# EAGLE design Qwiic_LoRa (EAGLE 7.7.0)
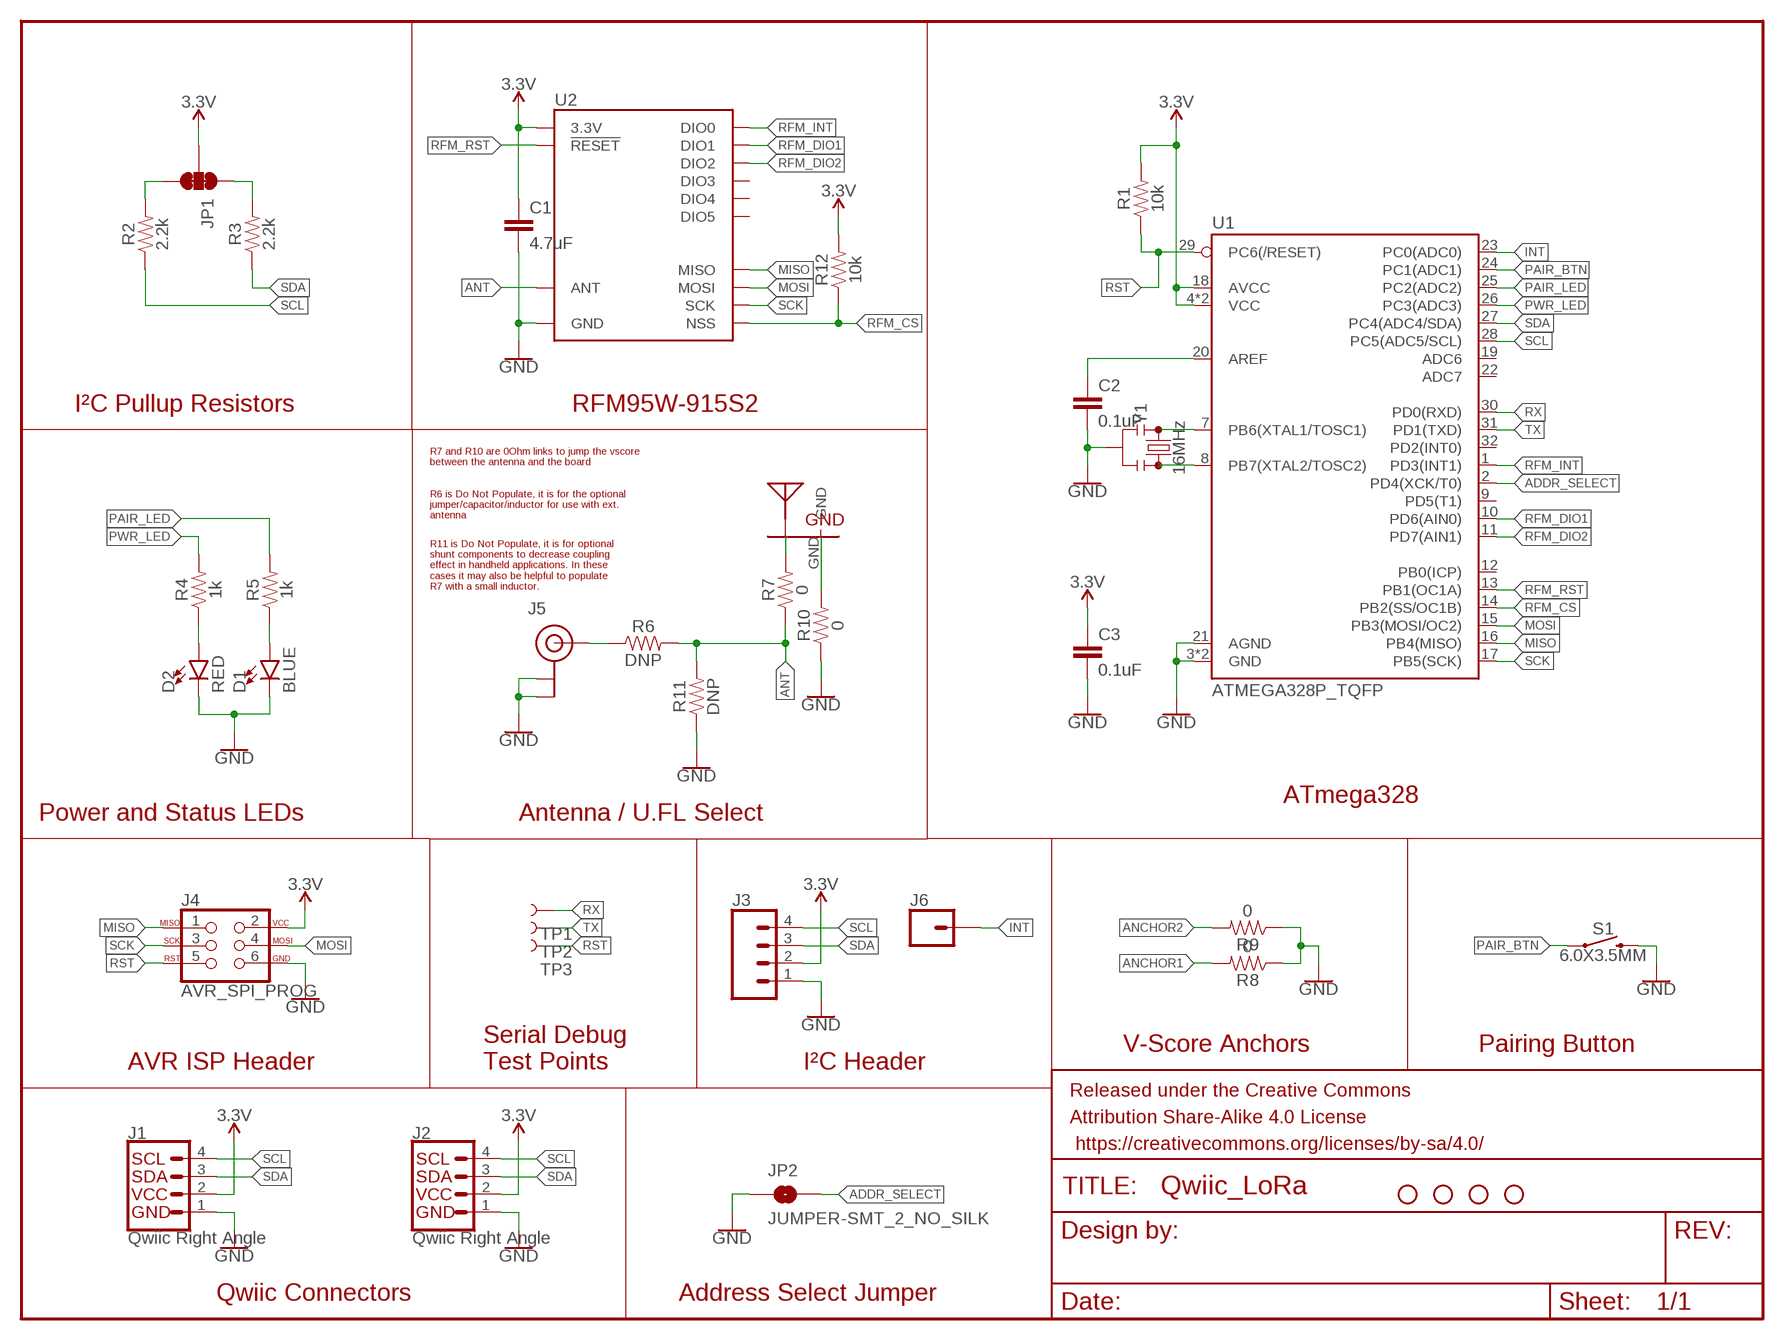
[diagram p0: schematic, sheet 1]

## Parts
C1  4.7uF  4.7UF0603  [0603]
C2  0.1uF  0.1UF-0603-25V-(+80/-20%)  [0603]
C3  0.1uF  0.1UF-0603-25V-(+80/-20%)  [0603]
D1  BLUE  LED-BLUE0603  [LED-0603]
D2  RED  LED-RED0603  [LED-0603]
FRAME1  FRAME-LETTER  [CREATIVE_COMMONS]
H1  STAND-OFF  [STAND-OFF]
H2  STAND-OFF  [STAND-OFF]
H3  STAND-OFF  [STAND-OFF]
H4  STAND-OFF  [STAND-OFF]
J1  Qwiic Right Angle  I2C_STANDARDQWIIC  [1X04_1MM_RA]
J2  Qwiic Right Angle  I2C_STANDARDQWIIC  [1X04_1MM_RA]
J3  CONN_041X04_NO_SILK  [1X04_NO_SILK]
J4  AVR_SPI_PROG  AVR_SPI_PROG_3X2TESTPOINTS  [2X3_TEST_POINTS]
J5  U.FL  [U.FL]
J6  CONN_01PTH_NO_SILK_YES_STOP  [1X01_NO_SILK]
JP1  JUMPER-SMT_3_2-NC_TRACE_SILK  [SMT-JUMPER_3_2-NC_TRACE_SILK]
JP2  JUMPER-SMT_2_NO_SILK  [SMT-JUMPER_2_NO_SILK]
R1  10k  10KOHM-0603-1/10W-1%  [0603]
R2  2.2k  2.2KOHM-0603-1/10W-1%  [0603]
R3  2.2k  2.2KOHM-0603-1/10W-1%  [0603]
R4  1k  1KOHM-0603-1/10W-1%  [0603]
R5  1k  1KOHM-0603-1/10W-1%  [0603]
R6  DNP  RESISTOR0603  [0603]
R7  0  RESISTOR0603  [0603]
R8  0  RESISTOR0603  [0603]
R9  0  RESISTOR0603  [0603]
R10  0  RESISTOR0603  [0603]
R11  DNP  RESISTOR0603  [0603]
R12  10k  10KOHM-0603-1/10W-1%  [0603]
S1  6.0X3.5MM  MOMENTARY-SWITCH-SPST-SMD-6.0X3.5MM  [TACTILE_SWITCH_SMD_6.0X3.5MM]
TP1  TEST-POINT3  [PAD.03X.03]
TP2  TEST-POINT3  [PAD.03X.03]
TP3  TEST-POINT3  [PAD.03X.03]
U1  ATMEGA328P_TQFP  [TQFP32-08]
U2  RFM96W  [RFM95/96/97/98W]
U$1  ANTENNA_915MHZ_INVERTED_F  [ANTENNA_INVERTED_F_915MHZ]
Y1  16MHz  RESONATOR-16MHZSMD_3.2X1.3  [RESONATOR-SMD-3.2X1.3]

## Nets
3.3V [3v3]: C1.1 C3.1 J1.2 J2.2 J3.2 J4.2 JP1.2 R1.2 R12.2 U1.4(VCC) U1.6(VCC) U1.18(AVCC) U2.3.3V
ADDR_SELECT: JP2.2 U1.2(PD4(XCK/T0))
ANCHOR1: R8.2
ANCHOR2: R9.2
ANT: R6.2 R7.1 R11.2 U2.ANT
GND: C1.2 C2.2 C3.2 D1.C D2.C J1.1 J2.1 J3.1 J4.6 J5.1(GND) J5.2(GND) JP2.1 R8.1 R9.1 R10.1 R11.1 S1.2 U1.3(GND) U1.5(GND) U1.21(AGND) U2.GND@1(GND) U2.GND@2(GND) U2.GND@3(GND) Y1.2
INT: J6.1 U1.23(PC0(ADC0))
MISO: J4.1 U1.16(PB4(MISO)) U2.MISO
MOSI: J4.4 U1.15(PB3(MOSI/OC2)) U2.MOSI
N$1: D2.A R4.1
N$2: D1.A R5.1
N$3: C2.1 U1.20(AREF)
N$4: U1.7(PB6(XTAL1/TOSC1)) Y1.1
N$5: U1.8(PB7(XTAL2/TOSC2)) Y1.3
N$6: R7.2 U$1.FEED
N$7: JP1.1 R3.2
N$8: JP1.3 R2.2
N$9: J5.FEED(SIGNAL) R6.1
N$11: R10.2 U$1.GND
PAIR_BTN: S1.1 U1.24(PC1(ADC1))
PAIR_LED: R5.2 U1.25(PC2(ADC2))
PWR_LED: R4.2 U1.26(PC3(ADC3))
RFM_CS: R12.1 U1.14(PB2(SS/OC1B)) U2.NSS
RFM_DIO1: U1.10(PD6(AIN0)) U2.DIO1
RFM_DIO2: U1.11(PD7(AIN1)) U2.DIO2
RFM_INT: U1.1(PD3(INT1)) U2.DIO0
RFM_RST: U1.13(PB1(OC1A)) U2.!RESET
RST: J4.5 R1.1 TP3.P$1 U1.29(PC6(/RESET))
RX: TP1.P$1 U1.30(PD0(RXD))
SCK: J4.3 U1.17(PB5(SCK)) U2.SCK
SCL: J1.4 J2.4 J3.4 R2.1 U1.28(PC5(ADC5/SCL))
SDA: J1.3 J2.3 J3.3 R3.1 U1.27(PC4(ADC4/SDA))
TX: TP2.P$1 U1.31(PD1(TXD))
Unconnected: U1.9(PD5(T1)) U1.12(PB0(ICP)) U1.19(ADC6) U1.22(ADC7) U1.32(PD2(INT0)) U2.DIO3 U2.DIO4 U2.DIO5

## Notes on the sheet
- I²C Pullup Resistors | RFM95W-915S2
- R7 and R10 are 0Ohm links to jump the vscore 
  between the antenna and the board
- R6 is Do Not Populate, it is for the optional 
  jumper/capacitor/inductor for use with ext.
  antenna
- R11 is Do Not Populate, it is for optional 
  shunt components to decrease coupling 
  effect in handheld applications. In these 
  cases it may also be helpful to populate 
  R7 with a small inductor.
- ATmega328
- Power and Status LEDs | Antenna / U.FL Select
- V-Score Anchors | Pairing Button
- AVR ISP Header
- Serial Debug
  Test Points
- I²C Header
- Qwiic Connectors | Address Select Jumper

## Library data of the parts
C1 = SparkFun-Capacitors:4.7UF: 4.7µF ceramic capacitors A capacitor is a passive two-terminal electrical component used to store electrical energy temporarily in an electric field.; PROD_ID: CAP-08280
C2 C3 = SparkFun-Capacitors:0.1UF: 0.1µF ceramic capacitors A capacitor is a passive two-terminal electrical component used to store electrical energy temporarily in an electric field.; PROD_ID: CAP-00810
D1 = SparkFun-LED:LED-BLUE: Blue SMD LED Used in manufacturing of various products at SparkFun Packages: 0603 - SMD 0603 package [Product Link] <http://www.digikey.com/product-detail/en/SMLE12BC7TT86/511-1589-2-ND/1641808> 1206 - SMD1206 package [Product Link] <http://www.digikey.com/product-detail/en/lite-on-inc/LTST-C150TBKT/160-1643-1-ND/573584> SparkFun Products: ESP8266 Thing-Dev Board <https://www.sparkfun.com/products/13711> RedBoard <https://www.sparkfun.com/products/12757>; PROD_ID: DIO-08575
D2 = SparkFun-LED:LED-RED: Red SMD LED Used in manufacturing of most products at SparkFun Packages: 0603 - SMD 0603 package [Product Link] <http://docs.avagotech.com/docs/AV02-0551EN> 0603 SMART - SMD 0603 SMART package ( more efficient and expensive)[Product Link] <http://www.osram-os.com/Graphics/XPic2/00077099_0.pdf> 1206 - SMD1206 package [Product Link] <https://www.sparkfun.com/datasheets/DevTools/LilyPad/Q150OVS4.pdff> SparkFun Products: Pro Mini 328 -5V <https://www.sparkfun.com/products/821> RedBoard <https://www.sparkfun.com/products/12757> IOIO-OTG <https://www.sparkfun.com/products/13613>; PROD_ID: DIO-00819
FRAME1 = SparkFun-Aesthetics:FRAME-LETTER: Schematic Frame - Letter Standard 8.5x11 US Letter frame
H1-H4 = SparkFun-Hardware:STAND-OFF: Stand Off Drill holes for mechanically mounting via screws, standoffs, etc. Note: Use the keepout ring to avoid running the screw head into surrounding components. Variant Overviews STAND-OFF - Mechanical footprint for a #4 phillips button head screw. STAND-OFF-TIGHT - Mechanical footprint for a #4 phillips button head screw, Example SparkFun Products Screw - Phillips Head (1/4", 4-40, 10 pack) <https://www.sparkfun.com/products/10453> (PRT-10453) Screw - Phillips Head (1/2", 4-40, 10 pack) <https://www.sparkfun.com/products/10452> (PRT-10452) Screw - Phillips Head (3/4", 4-40, 10 pack) <https://www.sparkfun.com/products/10451> (PRT-10451) Screw - Phillips Head (1", 4-40, 10 pack) <https://www.sparkfun.com/products/10450> (PRT-10450)
J1 J2 = SparkFun-Connectors:I2C_STANDARD: SparkFun I2C Standard Pinout Header SparkFun has standardized on a pinout for all I2C based sensor breakouts. This pinout allows I2C boards to be plugged directly into the headers on Arduino Uno compatible boards, and to be daisy chained easily. Example SparkFun Products: SparkFun Atmospheric Sensor Breakout - BME280 <https://www.sparkfun.com/products/13676> SparkFun Altitude/Pressure Sensor Breakout - MPL3115A2 <https://www.sparkfun.com/products/11084> SparkFun TOF Range Finder Sensor - VL6180 <https://www.sparkfun.com/products/12785>; PROD_ID: CONN-13694
J3 = SparkFun-Connectors:CONN_04: Multi connection point. Often used as Generic Header-pin footprint for 0.1 inch spaced/style header connections On any of the 0.1 inch spaced packages, you can populate with these: Break Away Headers - Straight <https://www.sparkfun.com/products/116> (PRT-00116) Break Away Male Headers - Right Angle <https://www.sparkfun.com/products/553> (PRT-00553) Female Headers <https://www.sparkfun.com/products/115> (PRT-00115) Break Away Headers - Machine Pin <https://www.sparkfun.com/products/117> (PRT-00117) Break Away Female Headers - Swiss Machine Pin <https://www.sparkfun.com/products/743> (PRT-00743) For SCREWTERMINALS and SPRING TERMINALS visit here: Screw Terimnals on SparkFun.com <https://www.sparkfun.com/search/results?term=Screw+Terminals> (5mm/3.5mm/2.54mm spacing) This device is also useful as a general connection point to wire up your design to another part of your project. Our various solder wires solder well into these plated through hole pads. Hook-Up Wire - Assortment (Stranded, 22 AWG) <https://www.sparkfun.com/products/11375> (PRT-11375) Hook-Up Wire - Assortment (Solid Core, 22 AWG) <https://www.sparkfun.com/products/11367> (PRT-11367) View the entire wire category on our website here <https://www.sparkfun.com/categories/141> Special notes: Molex polarized connector foot print use with SKU : PRT-08231 with associated crimp pins and housings. 1MM SMD Version SKU: PRT-10208; PROD_ID: CONN-09696
J4 = SparkFun-Connectors:AVR_SPI_PROG_3X2: AVR ISP 6 Pin This is the reduced ISP connector for AVR programming. Common on Arduino. This footprint will take up less PCB space and can be used with a 10-pin to 6-pin adapter such as SKU: BOB-08508 **Special note about "TEST_POINT" package. The stop mask is on the top side, so if you want your programming test points to be on the bottom of your board, make sure to place this package on the bottom side of the board. This also ensure that the orientation to program from the bottom side will be correct. SparkFun Products: SparkFun ISP Pogo Adapter <https://www.sparkfun.com/products/11591> - NS Tiny AVR Programmer <https://www.sparkfun.com/products/11801> -PTH
J5 = SparkFun-Connectors:U.FL: SMD Antenna Connector - U.FL 2mm height, 3.0mm x 3.0mm receptacle size. SparkFun Products: SparkFun WiFi Shield - ESP8266 <https://www.sparkfun.com/products/13287> SparkFun ESP8266 Thing <https://www.sparkfun.com/products/13231> SparkFun MiniGen - Pro Mini Signal Generator Shield <https://www.sparkfun.com/products/11420>; PROD_ID: CONN-09193; SF_ID: WRL-09144
J6 = SparkFun-Connectors:CONN_01: Single connection point. Often used as Generic Header-pin footprint for 0.1 inch spaced/style header connections On any of the 0.1 inch spaced packages, you can populate with these: Break Away Headers - Straight <https://www.sparkfun.com/products/116> (PRT-00116) Break Away Male Headers - Right Angle <https://www.sparkfun.com/products/553> (PRT-00553) Female Headers <https://www.sparkfun.com/products/115> (PRT-00115) Break Away Headers - Machine Pin <https://www.sparkfun.com/products/117> (PRT-00117) Break Away Female Headers - Swiss Machine Pin <https://www.sparkfun.com/products/743> (PRT-00743) This device is also useful as a general connection point to wire up your design to another part of your project. Our various solder wires solder well into these plated through hole pads. Hook-Up Wire - Assortment (Stranded, 22 AWG) <https://www.sparkfun.com/products/11375> (PRT-11375) Hook-Up Wire - Assortment (Solid Core, 22 AWG) <https://www.sparkfun.com/products/11367> (PRT-11367) View the entire wire category on our website here <https://www.sparkfun.com/categories/141> Special notes: SMTSO-256-ET is a "flush mount" nut for a 4-40 screw. We mostly use this on specialty testbeds; it is a nice way to connect hardware to your PCB at an adjustable hieght. Also note, the SNAP packages are for using a snappable style connector. We sell a baggie of snaps and they are also used on two LilyPad designs: Snap Assortment - 30 pack (male and female) <https://www.sparkfun.com/products/11347> (DEV-11347) LilyPad Arduino SimpleSnap <https://www.sparkfun.com/products/10941> (DEV-10941) LilyPad SimpleSnap Protoboard <https://www.sparkfun.com/products/10940> (DEV-10940)
JP1 = SparkFun-Jumpers:JUMPER-SMT_3_2-NC_TRACE: Normally closed trace jumper (2 of 2 connections) This jumper has a trace between all three pads so they are normally closed (NC). Use a razor knife to open the connection(s). For best results follow the IPC guidelines for cutting traces: Cutout at least 0.063 mm (0.005 in). Remove all loose material to clean up the cut area. Seal the cut with an approved epoxy. Reapply solder to reclose the connection(s).
JP2 = SparkFun-Jumpers:JUMPER-SMT_2_NO: Normally open jumper This jumper has two pads in close proximity to each other. Apply solder to close the connection. Round pads are easier to solder for beginners, but are a lot larger. SparkFun Product that uses the round pads: SparkFun EL Sequencer <https://www.sparkfun.com/products/12781>
R1 R12 = SparkFun-Resistors:10KOHM: 10kΩ resistor A resistor is a passive two-terminal electrical component that implements electrical resistance as a circuit element. Resistors act to reduce current flow, and, at the same time, act to lower voltage levels within circuits. - Wikipedia; PROD_ID: RES-00824
R2 R3 = SparkFun-Resistors:2.2KOHM: 2.2kΩ resistor A resistor is a passive two-terminal electrical component that implements electrical resistance as a circuit element. Resistors act to reduce current flow, and, at the same time, act to lower voltage levels within circuits. - Wikipedia; PROD_ID: RES-08272
R4 R5 = SparkFun-Resistors:1KOHM: 1kΩ resistor A resistor is a passive two-terminal electrical component that implements electrical resistance as a circuit element. Resistors act to reduce current flow, and, at the same time, act to lower voltage levels within circuits. - Wikipedia; PROD_ID: RES-07856
R6-R11 = SparkFun-Resistors:RESISTOR: Generic Resistor Package
S1 = SparkFun-Switches:MOMENTARY-SWITCH-SPST: Momentary Switch (Pushbutton) - SPST Normally-open (NO) SPST momentary switches (buttons, pushbuttons). Variants PTH-12MM - 12mm square, through-hole Momentary Pushbutton Switch - 12mm Square <https://www.sparkfun.com/products/9190> (COM-09190) PTH-6.0MM, PTH-6.0MM-KIT - 6.0mm square, through-hole Mini Pushbutton Switch <https://www.sparkfun.com/products/97> (COM-00097) KIT package intended for soldering kit's - only one side of pads' copper is exposed. PTH-RIGHT-ANGLE-KIT - Right-angle, through-hole Right Angle Tactile Button <https://www.sparkfun.com/products/10791> - Used on SparkFun BigTime Watch Kit <https://www.sparkfun.com/products/11734> SMD-12MM - 12mm square, surface-mount Tactile Button - SMD (12mm) <https://www.sparkfun.com/products/12993> (COM-12993) Used on SparkFun PicoBoard <https://www.sparkfun.com/products/11888> SMD-4.5MM - 4.5mm Square Trackball Switch Used on SparkFun Blackberry Trackballer Breakout <https://www.sparkfun.com/products/13169> SMD-4.6MMX2.8MM - 4.60mm x 2.80mm, surface mount Used on SparkFun SAMD21 Mini Breakout <https://www.sparkfun.com/products/13664> SMD-5.2MM, SMD-5.2-REDUNDANT - 5.2mm square, surface-mount Mini Pushbutton Switch - SMD <https://www.sparkfun.com/products/8720> (COM-08720) Used on Arduino Pro Mini <https://www.sparkfun.com/products/11114> REDUNDANT package connects both switch circuits together SMD-6.0X3.5MM - 6.0 x 3.5mm, surface mount Momentary Reset Switch SMD <https://www.sparkfun.com/products/8229> (COM-08229) SMD-6.2MM-TALL - 6.2mm square, surface mount Tactile Button - SMD (6mm) <https://www.sparkfun.com/products/12992> Used on SparkFun Digital Sandbox <https://www.sparkfun.com/products/12651> SMD-RIGHT-ANGLE - Right-angle, surface mount Used on SparkFun Block for Intel® Edison - Arduino <https://www.sparkfun.com/products/13036>; PROD_ID: SWCH-00815; SF_SKU: COM-08229
TP1-TP3 = SparkFun-Connectors:TEST-POINT: SparkFun Test Points Bare copper test points for troubleshooting or In-Circuit-Testing. These are used by our Production team for verifying production board runs using pogo-pins on test beds. SparkFun Products: SparkFun LSM9DS1 Breakout <https://www.sparkfun.com/products/13284> SparkFun PSOC <https://www.sparkfun.com/products/13714> SparkFun Load Cell Amplifier <https://www.sparkfun.com/products/13879>
U1 = SparkFun-IC-Microcontroller:ATMEGA328P_TQFP: Popular 328P in QFP Storefront component: ATmega328 - TQFP <https://www.sparkfun.com/products/13448> (COM-13448) Datasheet <http://www.sparkfun.com/datasheets/Components/SMD/ATMega328.pdf> SparkFun Products SparkFun RedBoard - Programmed with Arduino <https://www.sparkfun.com/products/12757> (DEV-12757) Arduino Pro Mini 328 - 5V/16MHz <https://www.sparkfun.com/products/11113> (DEV-11113) Arduino Pro Mini 328 - 3.3V/8MHz <https://www.sparkfun.com/products/11114> (DEV-11114) SparkFun OpenLog <https://www.sparkfun.com/products/13712> (DEV-13712) SparkFun MicroView - OLED Arduino Module <https://www.sparkfun.com/products/12923> (DEV-12923) SparkFun Digital Sandbox <https://www.sparkfun.com/products/12651> (DEV-12651) SparkFun PicoBoard <https://www.sparkfun.com/products/11888> (WIG-11888) Arduino Fio <https://www.sparkfun.com/products/10116> (DEV-10116) LilyPad Arduino 328 Main Board <https://www.sparkfun.com/products/13342> (DEV-13342) SparkFun RedStick <https://www.sparkfun.com/products/13741> (DEV-13741) LilyPad MP3 <https://www.sparkfun.com/products/11013> (DEV-11013) LilyPad Arduino SimpleSnap <https://www.sparkfun.com/products/10941> (DEV-10941) SparkFun Stepoko <https://www.sparkfun.com/products/13899> (ROB-13899) SparkFun Geiger Counter <https://www.sparkfun.com/products/11345> (SEN-11345) SparkFun EL Sequencer <https://www.sparkfun.com/products/12781> (COM-12781) Arduino Pro 328 - 5V/16MHz <https://www.sparkfun.com/products/10915> (DEV-10915) CryptoCape <https://www.sparkfun.com/products/12773> (DEV-12773) SparkFun IR Thermometer Evaluation Board - MLX90614 <https://www.sparkfun.com/products/10740> (SEN-10740) SparkFun RedBot Mainboard <https://www.sparkfun.com/products/12097> (ROB-12097) Arduino Pro 328 - 3.3V/8MHz <https://www.sparkfun.com/products/10914> (DEV-10914) SparkFun Block for Intel® Edison - Arduino <https://www.sparkfun.com/products/13036> (DEV-13036) SparkFun Simon Says - Surface Mount Soldering Kit <https://www.sparkfun.com/products/10935> (KIT-10935) SparkFun 7-Segment Serial Display - Red <https://www.sparkfun.com/products/11441> (COM-11441) SparkFun 7-Segment Serial Display - White <https://www.sparkfun.com/products/11629> (COM-11629) SparkFun 7-Segment Serial Display - Yellow <https://www.sparkfun.com/products/11443> (COM-11443) SparkFun 7-Segment Serial Display - Kelly Green <https://www.sparkfun.com/products/11440> (COM-11440) SparkFun 7-Segment Serial Display - Blue <https://www.sparkfun.com/products/11442> (COM-11442) SparkFun OpenSegment Serial Display - 20mm (Blue) <https://www.sparkfun.com/products/11647> (COM-11647) SparkFun OpenSegment Serial Display - 20mm (Green) <https://www.sparkfun.com/products/11646> (COM-11646) SparkFun OpenSegment Serial Display - 20mm (White) <https://www.sparkfun.com/products/11648> (COM-11648) SparkFun OpenSegment Serial Display - 20mm (Red) <https://www.sparkfun.com/products/11644> (COM-11644) SparkFun OpenSegment Serial Display - 20mm (Yellow) <https://www.sparkfun.com/products/11645> (COM-11645) SparkFun OpenSegment Shield <https://www.sparkfun.com/products/13190> (DEV-13190); PROD_ID: IC-09069
U2 = SparkX:RFM96W
U$1 = SparkX:ANTENNA_915MHZ_INVERTED_F
Y1 = SparkFun-Clocks:RESONATOR-16MHZ: 16MHz Resonator Digikey Example <http://www.digikey.com/product-detail/en/murata-electronics-north-america/CSTCE16M0V53-R0/490-1198-1-ND/584635> Frequency: 16MHz Frequency Stability: ±0.3% Frequency Tolerance: ±0.5% Capacitance: 15pF SparkFun Products SparkFun OpenLog <https://www.sparkfun.com/products/13712> SparkFun MicroView - OLED Arduino Module <https://www.sparkfun.com/products/12923>; PROD_ID: XTAL-08900

## Net classes
0 default: width 0.152 mm, drill 0.305 mm
1 3v3: width 0.203 mm, drill 0.305 mm

## Board
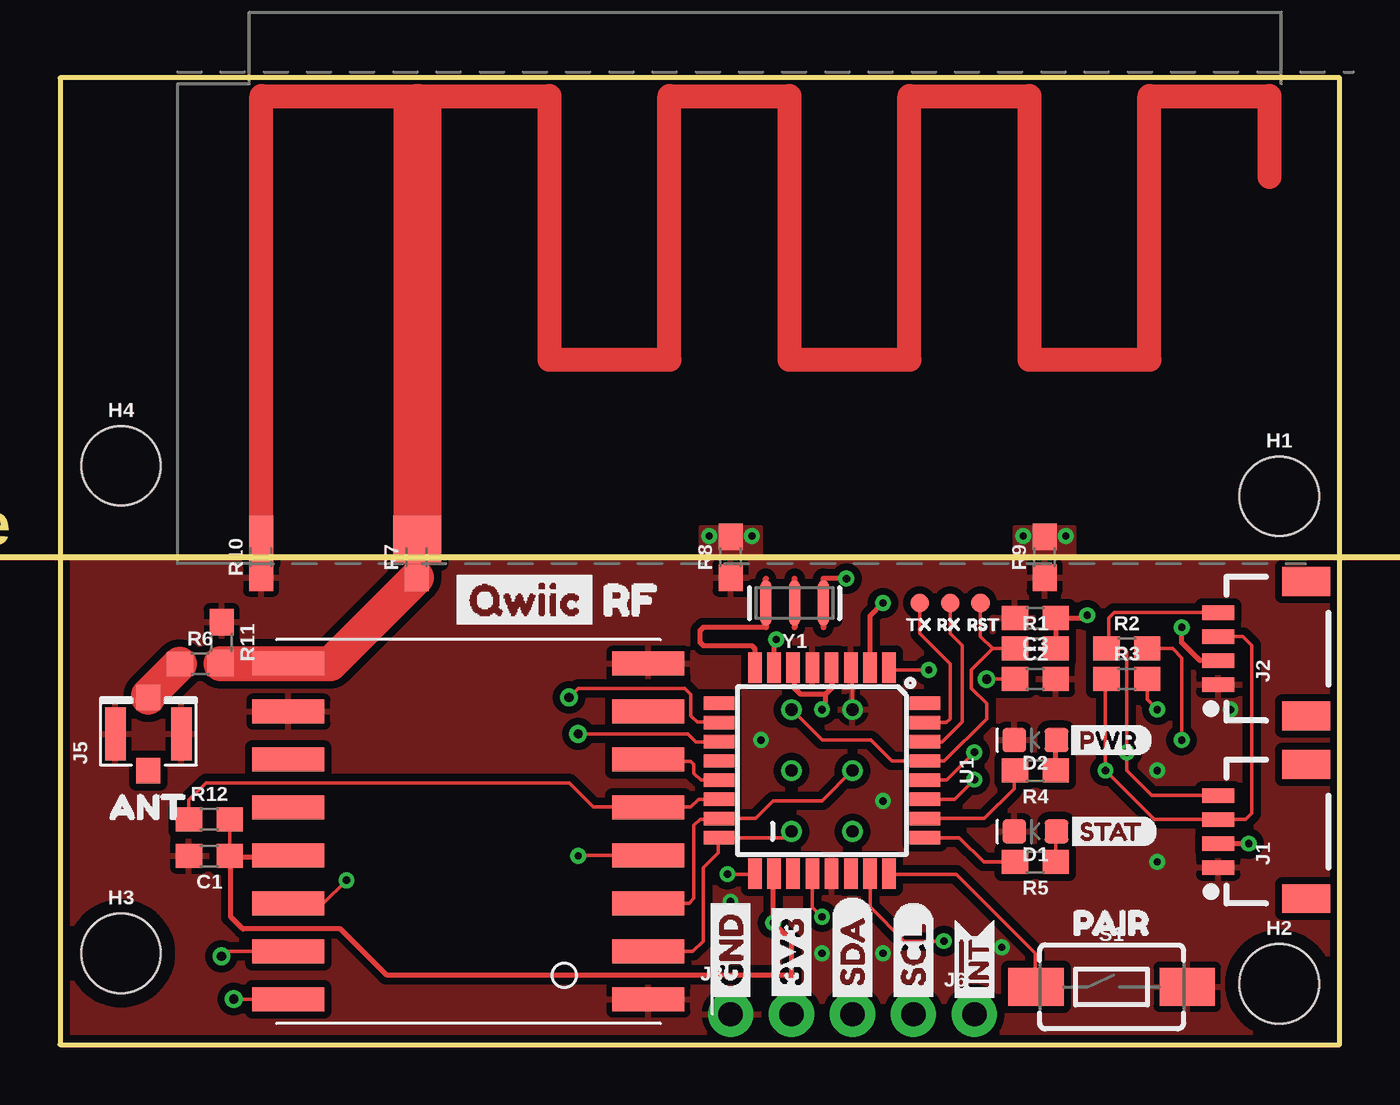
[diagram p1: board, top side]
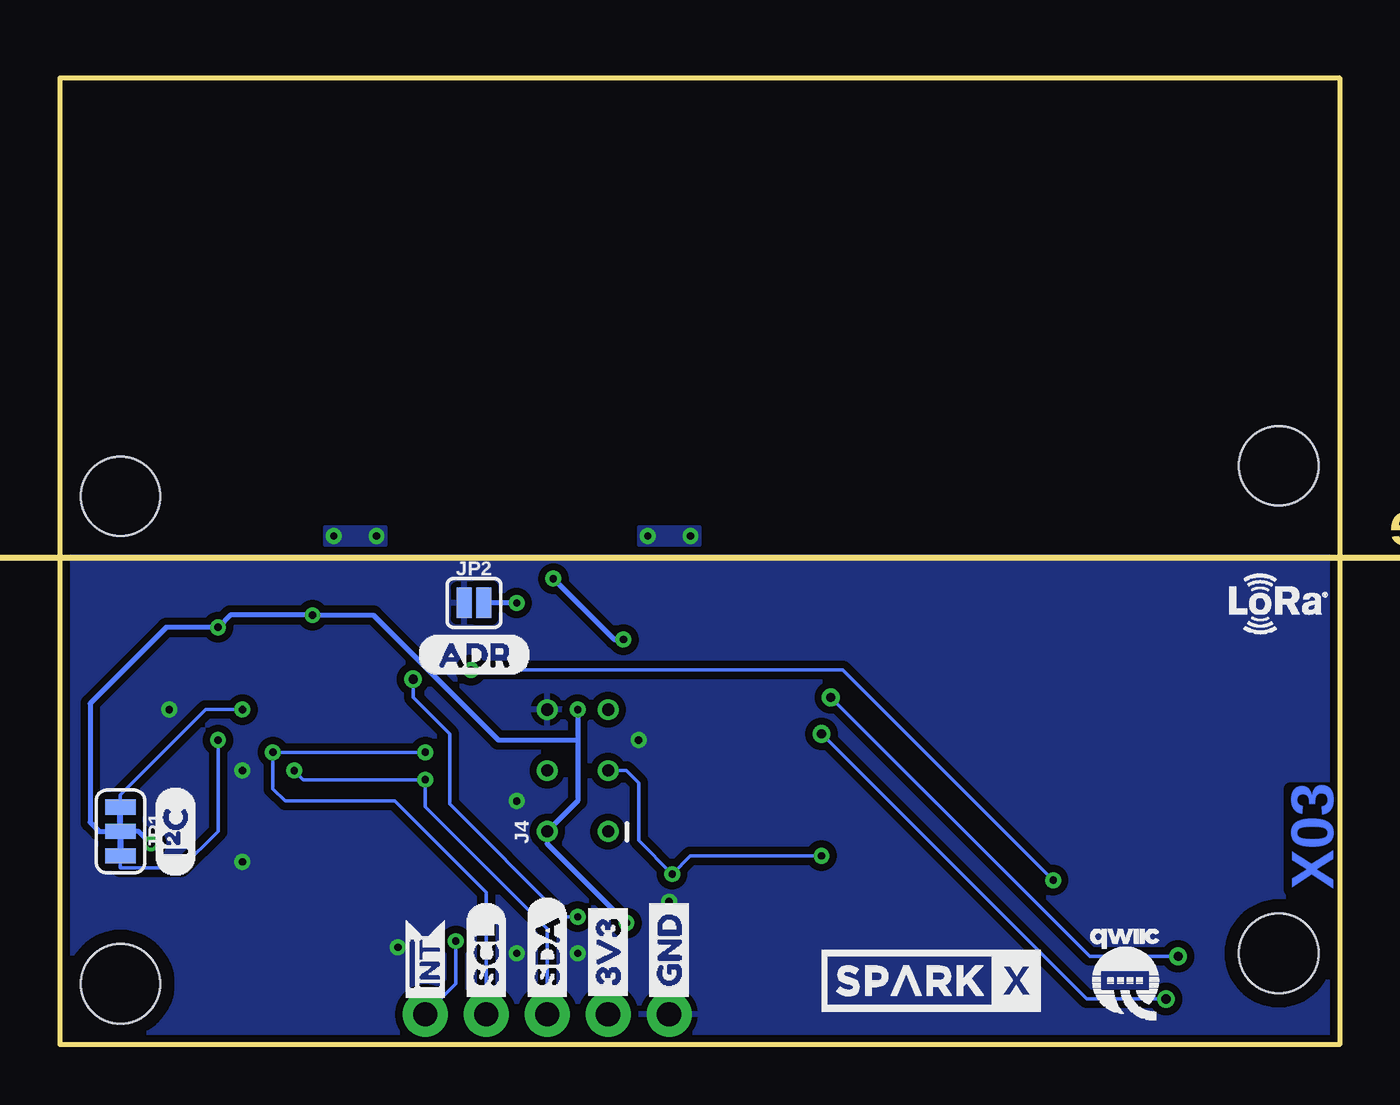
[diagram p2: board, bottom side, seen from below]

Size 53.32 x 40.31 mm. Coordinates in mm from the lower left corner, seen from the top.
Outline: 0,0 53.32,0 53.32,40.31 0,40.31 0,0
Copper layers (1*16): Top 0.035mm / dielectric 1.5mm / Bottom 0.035mm
Design rules "SparkFun-2-layer-PCBWay-LIMIT": minimum track width 6mil, minimum drill 0.3mm, track to track 6mil, track to pad 6mil, pad to pad 6mil, via to via 6mil, smd to smd 6mil, copper to edge 6mil, drill to drill 6mil, minimum pad ring 7mil, minimum via ring 7mil, stop-mask expansion 4mil, vias tented up to drill 25mil, thermal gap 10mil
Milling: 1 lines

### Footprints (pad centres in the part's own frame; a part is rotated, then mirrored left to right if it is on the bottom)
0603 = smd 1.1 x 1: 1 -0.85,0; 2 0.85,0
LED-0603 = smd 1 x 1: A -0.877,0; C 0.877,0
STAND-OFF = hole 3.302: 0,0
1X04_1MM_RA = smd 0.6 x 1.35: 1 -1.5,0; 2 -0.5,0; 3 0.5,0; 4 1.5,0 | smd 1.2 x 2: NC1 2.8,-3.675; NC2 -2.8,-3.675
1X04_NO_SILK = drill 1.016 pad 1.88: 1 0,0; 2 2.54,0; 3 5.08,0; 4 7.62,0
2X3_TEST_POINTS = drill 0.508: 1 -2.54,-1.27; 2 -2.54,1.27; 3 0,-1.27; 4 0,1.27; 5 2.54,-1.27; 6 2.54,1.27
U.FL = smd 2.2 x 0.85: 1 0,1.375; 2 0,-1.375 | smd 1.05 x 1: FEED 1.525,0; NC -1.525,0
1X01_NO_SILK = drill 1.016 pad 1.88: 1 0,0
SMT-JUMPER_3_2-NC_TRACE_SILK = smd 0.635 x 1.27: 1 -1.016,0; 2 0,0; 3 1.016,0
SMT-JUMPER_2_NO_SILK = smd 0.635 x 1.27: 1 -0.406,0; 2 0.406,0
TACTILE_SWITCH_SMD_6.0X3.5MM = smd 2.3 x 1.6: 1 -3.15,0; 2 3.15,0
PAD.03X.03 = smd 0.762 x 0.762: P$1 0,0
TQFP32-08 = smd 1.27 x 0.559: 1 -4.293,2.8; 2 -4.293,2; 3 -4.293,1.2; 4 -4.293,0.4; 5 -4.293,-0.4; 6 -4.293,-1.2; 7 -4.293,-2; 8 -4.293,-2.8; 17 4.293,-2.8; 18 4.293,-2; 19 4.293,-1.2; 20 4.293,-0.4; 21 4.293,0.4; 22 4.293,1.2; 23 4.293,2; 24 4.293,2.8 | smd 0.559 x 1.27: 9 -2.8,-4.293; 10 -2,-4.293; 11 -1.2,-4.293; 12 -0.4,-4.293; 13 0.4,-4.293; 14 1.2,-4.293; 15 2,-4.293; 16 2.8,-4.293; 25 2.8,4.293; 26 2,4.293; 27 1.2,4.293; 28 0.4,4.293; 29 -0.4,4.293; 30 -1.2,4.293; 31 -2,4.293; 32 -2.8,4.293
RFM95/96/97/98W = smd 3 x 1: 3.3V 7.5,1; !RESET -7.5,-3; ANT 7.5,-7; DIO0 7.5,3; DIO1 7.5,5; DIO2 7.5,7; DIO3 7.5,-3; DIO4 7.5,-1; DIO5 -7.5,-5; GND@1 -7.5,7; GND@2 -7.5,-7; GND@3 7.5,-5; MISO -7.5,5; MOSI -7.5,3; NSS -7.5,-1; SCK -7.5,1
ANTENNA_INVERTED_F_915MHZ = smd 2 x 2: FEED 6,2 | smd 1 x 2: GND -0.5,2
RESONATOR-SMD-3.2X1.3 = smd 0.45 x 1.905: 1 -1.2,0; 2 0,0; 3 1.2,0

### Placement (x,y rotation side)
C1  6.22,7.87 180 top
C2  40.64,15.24 0 top
C3  40.64,17.78 180 top
D1  40.64,8.89 180 top
D2  40.64,12.7 180 top
FRAME1  20.32,-10.16 0 top  (outside the outline)
H1  50.8,22.86 0 top
H2  50.8,2.54 0 top
H3  2.54,3.81 0 top
H4  2.54,24.13 0 top
J1  48.26,8.89 90 top
J2  48.26,16.51 90 top
J3  27.94,1.27 0 top
J4  31.75,11.43 90 bottom
J5  3.68,12.95 90 top
J6  38.1,1.27 0 top
JP1  50.8,8.89 270 bottom
JP2  36.07,18.41 0 bottom
R1  40.64,16.51 0 top
R2  44.45,16.51 0 top
R3  44.45,15.24 0 top
R4  40.64,11.43 180 top
R5  40.64,7.62 180 top
R6  5.84,15.88 0 top
R7  14.86,20.32 90 top
R8  27.94,20.32 90 top
R9  41.02,20.32 90 top
R10  8.38,20.32 90 top
R11  6.73,16.76 270 top
R12  6.22,9.4 0 top
S1  43.81,2.41 0 top
TP1  37.08,18.41 0 top
TP2  35.81,18.41 0 top
TP3  38.35,18.41 0 top
U1  31.75,11.43 270 top
U2  17.02,8.89 180 top
U$1  8.89,19.05 0 top
U$2  [ANT0]  1.14,9.91 0 top
U$3  [PAIR1]  41.27,5.08 0 top
U$4  [SDA-[)]  33.02,1.52 90 top
U$5  [SCL-[)]  35.56,1.52 90 top
U$6  [GND-04]  27.94,1.52 90 top
U$7  [3V3-04]  30.48,1.52 90 top
U$8  [PWR1]  41.78,12.7 0 top
U$9  [STAT2]  41.78,8.89 0 top
U$10  [QWIIC-LOGO-SMALL]  9.02,2.92 0 bottom
U$11  [TX1]  34.8,17.53 0 top
U$12  [INT#-[<]  38.1,1.27 90 top
U$13  [SPARKX-MEDIUM]  17.02,2.67 0 bottom
U$14  [ADR-()]  38.48,16.26 0 bottom
U$15  [RF1]  21.46,18.54 0 top
U$16  [QWIIC0]  15.88,18.54 0 top
U$17  [LORA_MARK#PNG]  2.67,18.41 0 bottom
U$18  [GND-04]  27.94,1.52 90 top
U$19  [GND-04]  27.94,1.52 90 bottom
U$20  [3V3-04]  30.48,1.52 90 top
U$21  [3V3-04]  30.48,1.52 90 bottom
U$22  [SDA-[)]  33.02,1.52 90 bottom
U$23  [SCL-[)]  35.56,1.52 90 bottom
U$24  [INT#-[<]  38.1,1.27 90 bottom
U$25  [I_SUPER2_C-()-04]  48.51,6.99 90 bottom
U$26  [PRODUCTION_INSTRUCTIONS]  60.96,50.8 0 top  (outside the outline)
U$27  [RX0]  36.07,17.53 0 top
U$28  [RST2]  37.34,17.53 0 top
Y1  30.61,18.41 180 top

### Tracks (layer width: path | path; a pad name or v marks a point on that pad's centre or on a via)
3.3V  (via drill 0.3)
  Top 0.152: R12.2 C1.1
  Top 0.203: J3.2 30.48,2.92 | 30.48,2.92 30.48,4.32 v29.72,5.08 29.72,7.11 U1.18 | 30.48,2.92 13.59,2.92 11.68,4.83 7.62,4.83 7.11,5.33 7.11,7.83 | J1.2 v49.52,8.39 v49.53,8.38 | J2.2 47.49,16.01 46.74,16.76 v46.74,17.4 | U1.4 32.15,14.88 31.88,14.61 | 31.88,14.61 30.86,14.61 30.61,14.86 30.61,15.67 U1.6 | 31.88,14.61 31.88,14.1 v31.75,13.97 | 41.53,16.55 R1.2 C3.1 42.67,17.78 v42.8,17.91 | 7.11,7.83 C1.1 | 7.11,7.83 9.46,7.83 U2.3.3V
  Bottom 0.203: v49.53,8.38 50.04,8.89 JP1.2 51.69,8.89 52.07,9.27 52.07,14.22 48.9,17.4 v46.74,17.4 46.23,17.91 v42.8,17.91 40.26,17.91 35.05,12.7 31.75,12.7 | v29.72,5.08 33.02,8.38 J4.2 31.75,10.16 31.75,12.7 | v31.75,13.97 31.75,12.7
ADDR_SELECT  (via drill 0.3)
  Top 0.203: U1.2 33.75,17.88 v34.29,18.41
  Bottom 0.203: v34.29,18.41 JP2.2
ANCHOR1  (via drill 0.3)
  other vias: 27.05,21.21 28.83,21.21
  pour Top (isolate 0.305, no thermals): 26.67,21.59 29.21,21.59 29.21,20.32 26.67,20.32
  pour Bottom (isolate 0.305, no thermals): 26.67,21.59 29.21,21.59 29.21,20.83 26.67,20.83
ANCHOR2  (via drill 0.3)
  other vias: 40.13,21.21 41.91,21.21
  pour Bottom (isolate 0.305, no thermals): 39.75,21.59 42.29,21.59 42.29,20.83 39.75,20.83
  pour Top (isolate 0.305, no thermals): 39.75,21.59 42.29,21.59 42.29,20.32 39.75,20.32
ANT
  Top 0.254: R11.2 R6.2
  Top 1.448: 6.71,15.89 U2.ANT 11.28,15.89 | R6.2 11.26,15.88 11.28,15.89 | 11.28,15.89 R7.1
GND  (via drill 0.3)
  Top 0.152: J4.6 33.02,15.65 U1.3
  other vias: 48.77,13.97 29.21,12.7 27.94,5.97 45.72,11.43 34.29,10.16 45.72,7.62 31.75,3.81 34.29,3.81 39.24,4.06
  pour Bottom (isolate 0.305): 0,20.32 53.34,20.32 53.34,0 0,0
  pour Top (isolate 0.305): 0,20.32 53.34,20.32 53.34,0 0,0
INT  (via drill 0.3)
  Top 0.152: U1.23 33.75,5.75 35.18,4.32 v36.83,4.32
  Bottom 0.152: v36.83,4.32 36.83,2.54 J6.1
MISO
  Top 0.152: J4.1 30.22,8.63 U1.16 27.43,8.61 27.43,8 26.8,7.37 26.8,4.32 26.37,3.89 U2.MISO
MOSI
  Top 0.152: J4.4 31.75,10.16 29.72,10.16 28.99,9.43 U1.15 27.43,9.4 26.67,9.4 26.42,9.14 26.42,6.1 26.21,5.89 U2.MOSI
N$1
  Top 0.152: R4.1 41.49,11.4
  Top 0.203: 41.49,11.4 41.49,12.67 D2.A
N$2
  Top 0.152: R5.1 41.49,8.86 D1.A
N$3  (via drill 0.3, 0.38)
  Top 0.152: U1.20 31.35,5.73 v31.75,5.33 | 39.75,15.2 C2.1 v38.61,15.24
  Bottom 0.152: v31.75,5.33 32.38,5.33 37.08,10.03 37.08,12.95 38.61,14.48 v38.61,15.24
N$4  (via drill 0.3)
  Top 0.203: U1.7 29.75,16.8 v29.84,16.89 | v32.77,19.43 31.81,19.43
  Bottom 0.203: v29.84,16.89 30.23,16.89 v32.77,19.43
N$5
  Top 0.152: U1.8
  Top 0.203: U1.8 28.96,16.51 28.83,16.64 26.8,16.64 26.67,16.76 26.67,17.27 26.8,17.4 29.41,17.4
N$6
  Top 0.203: R7.2 14.86,21.08 U$1.FEED
N$7  (via drill 0.3)
  Top 0.152: R3.2 45.3,14.39 v45.72,13.97
  Bottom 0.152: v45.72,13.97 47.24,13.97 50.8,10.41 JP1.1
N$8  (via drill 0.3)
  Top 0.152: R2.2 46.35,16.51 46.74,16.13 v46.74,12.7
  Bottom 0.152: v46.74,12.7 46.74,8.89 48.26,7.37 50.8,7.37 JP1.3
N$9
  Top 1.448: J5.FEED 3.68,14.57 R6.1
N$11
  Top 0.254: U$1.GND R10.2
PAIR_BTN
  Top 0.152: U1.24 34.58,7.11 37.34,7.11 40.64,3.81 40.64,2.44 S1.1
PAIR_LED
  Top 0.152: U1.25 37.47,8.63 38.48,7.62 R5.2
PWR_LED
  Top 0.152: U1.26 38.51,9.43 39.75,10.67 39.75,11.39 R4.2
RFM_CS
  Top 0.152: U1.14 26.61,10.23 26.29,9.91 24.53,9.91 U2.NSS 24.5,9.91 22.23,9.91 21.21,10.92 6.1,10.92 5.37,10.2 R12.1
RFM_DIO1  (via drill 0.38)
  Top 0.152: U2.DIO1 6.94,3.89 v6.73,3.68 | v21.21,14.48 21.59,14.86 26.04,14.86 26.29,14.61 26.29,13.72 26.54,13.46 27.43,13.46 U1.10
  Bottom 0.152: v6.73,3.68 10.41,3.68 v21.21,14.48
RFM_DIO2  (via drill 0.38)
  Top 0.152: U2.DIO2 7.25,1.89 v7.24,1.91 | v21.59,12.95 26.16,12.95 26.49,12.63 U1.11
  Bottom 0.152: v7.24,1.91 10.54,1.91 v21.59,12.95
RFM_INT  (via drill 0.3)
  Top 0.152: v11.94,6.86 10.97,5.89 U2.DIO0 | v36.2,15.62 34.65,15.62 U1.1
  Bottom 0.152: v11.94,6.86 20.7,15.62 v36.2,15.62
RFM_RST
  Top 0.152: U1.13 26.69,11.03 26.42,11.3 26.42,11.68 26.29,11.81 24.6,11.81 U2.!RESET
RST
  Top 0.152: J4.5 31.75,12.7 33.78,12.7 34.65,11.83 U1.29 36.85,11.83 38.61,13.59 38.61,14.22 37.97,14.86 37.97,15.62 38.86,16.51 | 38.86,16.51 R1.1 | TP3.P$1 38.35,17.02 38.86,16.51
RX
  Top 0.152: U1.30 36.76,12.63 37.59,13.46 37.59,16.64 37.08,17.14 TP1.P$1
SCK  (via drill 0.3)
  Top 0.152: v21.59,7.87 21.61,7.89 U2.SCK | v27.81,7.11 28.93,7.11 U1.17
  Bottom 0.152: v21.59,7.87 27.05,7.87 v27.81,7.11 29.21,8.51 29.21,10.92 29.72,11.43 J4.3
SCL  (via drill 0.3)
  Top 0.152: J1.4 45.49,10.39 44.45,11.43 v44.45,12.19 44.45,16.38 44.32,16.51 R2.1 43.69,16.6 43.69,17.78 43.92,18.01 J2.4 | U1.28 36.94,11.03 v38.1,12.19
  Bottom 0.152: v38.1,12.19 v44.45,12.19 44.45,10.67 43.94,10.16 39.37,10.16 35.56,6.35 J3.4
SDA  (via drill 0.3)
  Top 0.152: 43.56,15.2 v43.56,11.43 45.6,9.39 J1.3 49.4,9.4 49.66,9.65 49.66,16.64 49.28,17.01 J2.3 | U1.27 37.28,10.23 v38.1,11.05
  Top 0.203: 43.56,15.2 R3.1
  Bottom 0.152: v43.56,11.43 43.18,11.05 v38.1,11.05 38.1,9.91 33.02,4.83 J3.3
TX
  Top 0.152: U1.31 36.92,13.43 37.08,13.59 37.08,15.88 35.81,17.14 TP2.P$1

### Text on the board
Bottom: X03
Milling: vscore
tDocu: 0.8mm Thickness PCB | RFM95W / 915MHz | NPoole 2018